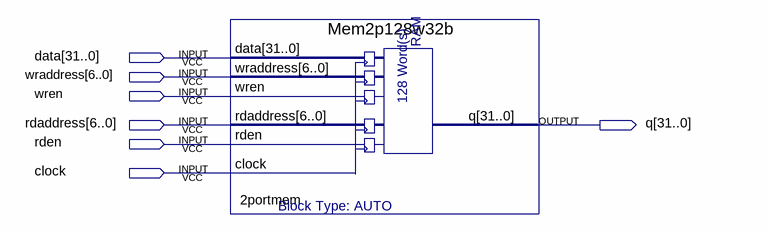
[diagram p0: schematic sheet]
// Quartus schematic MemBlock.bdf as structural Verilog: 1 symbols, 7 pins
module MemBlock (
  input  [31:0] data,
  input  [6:0] wraddress,
  input  wren,
  input  [6:0] rdaddress,
  input  rden,
  input  clock,
  output [31:0] q
);

  Mem2p128w32b u_2portmem (
    .data(data), .wraddress(wraddress), .wren(wren), .rdaddress(rdaddress), .rden(rden), .clock(clock), .q(q));
endmodule
